# EasyEDA Pro project schematic and PCB.eprj

# Schematic Schematic1
Board Name: Board1; Create Date: 2025-03-21; Page Name: P1; Project Name: New Project_2025-03-21_12-21-42; Schematic Name: Schematic1; Update Date: 2025-03-21; Company: 嘉立创EDA; Page Size: A4; Version: V1.0
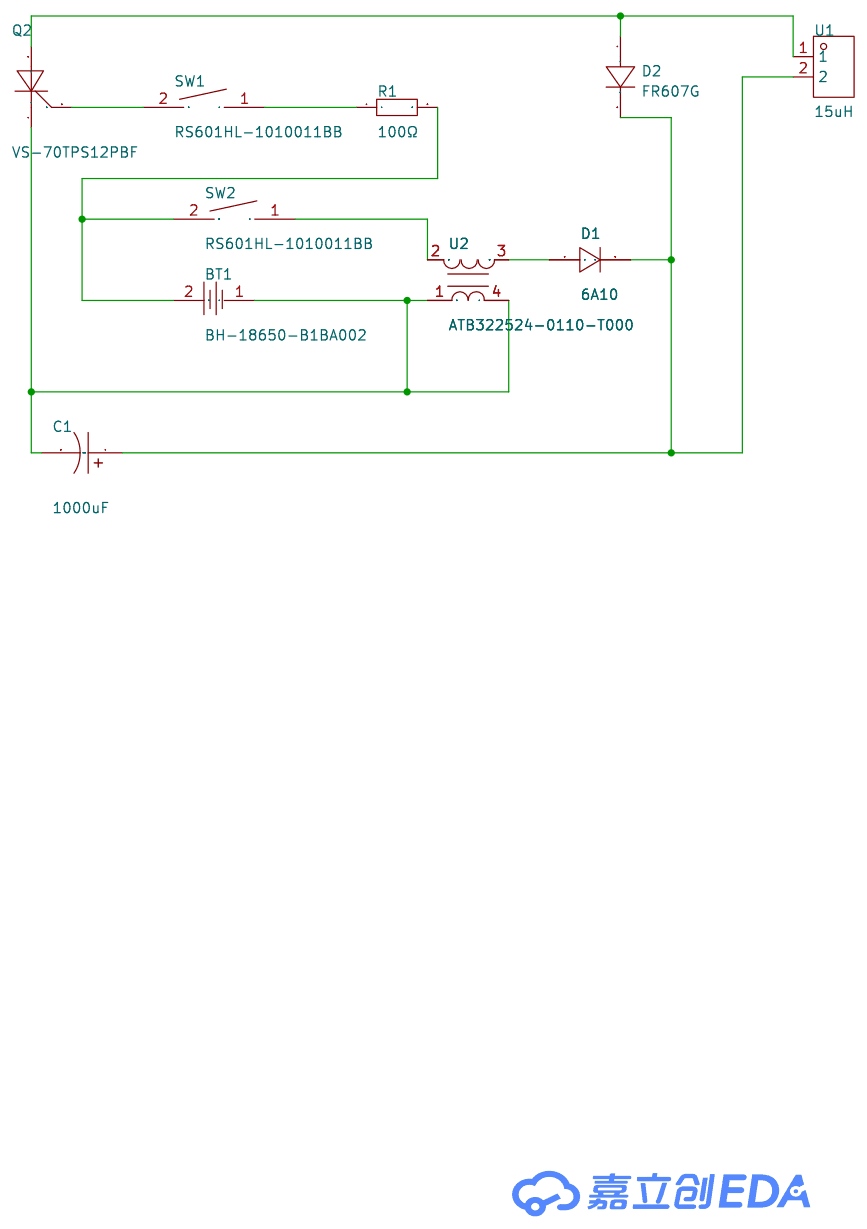
[diagram p0: schematic sheet]

## Parts
BT1  BH-18650-B1BA002  [BATTERY-SMD_18650-1S-L77.1-W20.7-1]
C1  1000uF  [CAP-TH_BD30.0-P10.00-D2.3-FD-1]
D1  6A10  [R-6_BD9.0-L9.0-W9.0-P15.00-D1.7-FD]
D2  FR607G  [DIO-TH_BD8.9-L8.9-P12.85-D1.3-FD]
Q2  VS-70TPS12PBF  [TO-247-3_L15.9-W5.1-P5.44-L]
R1  100Ω  [RES-TH_BD5.0-L15.5-P19.50-D0.70]
SW1  RS601HL-1010011BB  [SW-TH_RS601HL-1010011BB]
SW2  RS601HL-1010011BB  [SW-TH_RS601HL-1010011BB]
U1  15uH  [CND-TEK-SMD_YX-A11-R501053-G0807]
U2  ATB322524-0110-T000  [XFMR-SMD_ATB322515-0110-T000]

## Library data of the parts
BT1 = BH-18650-B1BA002: LCSC Part Name: 电池盒 适用电池:18650; Supplier Part: C2988620; Manufacturer: MYOUNG(美阳); Supplier Footprint: SMD; JLCPCB Part Class: Extended Part; Datasheet: https://atta.szlcsc.com/upload/public/pdf/source/20220402/870DB99AB50CA0DF8D51CF7C86A51FAB.pdf; Supplier: LCSC; Connector Type: 电池盒; Battery Type: 18650
C1 = EKHE451VSN102MR60Z: LCSC Part Name: 1000uF ±20% 450V; Supplier Part: C5142265; Manufacturer: NCC(日本贵弥功); Supplier Footprint: 插件,D30xL60mm; JLCPCB Part Class: Extended Part; Supplier: LCSC; Tolerance: ±20%; Rated Voltage: 450V; φD: 30mm; L: 60mm; Operating Temperature: -25℃~+105℃
D1 = 6A10_C2461: Supplier Part: C2461; Manufacturer: MDD(辰达半导体); Supplier Footprint: R-6; JLCPCB Part Class: Extended Part; Datasheet: https://atta.szlcsc.com/upload/public/pdf/source/20240809/06A0A2C508F91ACDB247A28AEBF87D37.pdf; Supplier: LCSC; Voltage - Forward(Vf@If): 1V@6A; Voltage - DC Reverse(Vr): 1kV; Current - Rectified: 6A; Reverse Leakage Current (Ir): 10uA@1kV
D2 = FR607G: Supplier Part: C961805; Manufacturer: YANGJIE(扬杰); Supplier Footprint: R-6; JLCPCB Part Class: Extended Part; Datasheet: https://atta.szlcsc.com/upload/public/pdf/source/20201127/C961804_3372E6F77B30107D789073F381F4B319.pdf; Supplier: LCSC; Diode Configuration: 独立式; Voltage - Forward(Vf@If): 1.3V@6A; Voltage - DC Reverse(Vr): 1kV; Current - Rectified: 6A; Reverse Leakage Current (Ir): 2.5uA@1kV; Operating Temperature: -55℃~+150℃@(Tj)
Q2 = VS-70TPS12PBF: Supplier Part: C335786; Manufacturer: VISHAY(威世); Supplier Footprint: TO-247-3; JLCPCB Part Class: Extended Part; Datasheet: https://atta.szlcsc.com/upload/public/pdf/source/20181127/C335786_D8343C7FDE24B71D681DA03209FAC9C4.pdf; Supplier: LCSC
R1 = MFR02SF1000A10: LCSC Part Name: 100Ω ±1% 2W 金属膜电阻 小体积,铜脚，圆柱状直插; Supplier Part: C58717; Manufacturer: UNI-ROYAL(厚声); Supplier Footprint: 插件,D4xL11.5mm; JLCPCB Part Class: Extended Part; Datasheet: https://atta.szlcsc.com/upload/public/pdf/source/20191012/C436293_8820AA14BC71FA35E551C06C441482A0.pdf; Supplier: LCSC; Type: 金属膜电阻; Tolerance: ±1%; Voltage-Supply(Max): 500V; Power(Watts): 2W; Temperature Coefficient: ±50ppm/℃
SW1 SW2 = RS601HL-1010011BB: Supplier Part: C2885782; Manufacturer: HCTL(华灿天禄); Supplier Footprint: 插件; JLCPCB Part Class: Extended Part; Datasheet: https://atta.szlcsc.com/upload/public/pdf/source/20210820/B1970E40D09304D7FA648AE2099FB3E8.pdf; Supplier: LCSC; Switch Length: 15mm; Switch Width: 10.5mm; Switch Height: 11.7mm; Actuator Type: 凹面弯曲; With Lamp: 无; Pin Style: 焊片; Actuator Color: 黑色; Contact Current: 3A; Voltage Rating (AC): 250V; Circuit: 单刀单掷; Mechanical Life: 1万次; Operating Temperature: -25℃~+85℃; Actuator Identifier: - O
U1 = YX-A11-R500800-R0890: Supplier Part: C3003210; Manufacturer: CND-tek(磁联达); JLCPCB Part Class: Extended Part; Datasheet: https://atta.szlcsc.com/upload/public/pdf/source/20220506/4D0CC8BB7166D52E801353293D8C1412.pdf; Supplier: LCSC; Function: 发射器; Tolerance: ±10%; Number of Coils: 单线圈,单层; Operating Temperature: -40℃~+85℃
U2 = ATB322524-0110-T000: LCSC Part Name: 升压变压器; Supplier Part: C249001; Manufacturer: TDK; Supplier Footprint: SMD; JLCPCB Part Class: Extended Part; Datasheet: https://atta.szlcsc.com/upload/public/pdf/source/20180719/C249001_45035A300399F2A41F111958812A8988.pdf; Supplier: LCSC

## Nets
$1N757: D2.1 Q2.2(A) U1.1
$1N764: C1.1 D1.2(K) D2.2 U1.2
$1N791: BT1.1 C1.2 Q2.1(K) U2.1 U2.4
$1N998: Q2.3(G) SW1.2
$1N1002: R1.1 SW1.1
$1N1009: BT1.2 R1.2 SW2.2
$1N1038: SW2.1 U2.2
$1N1136: D1.1(A) U2.3

# Board PCB1
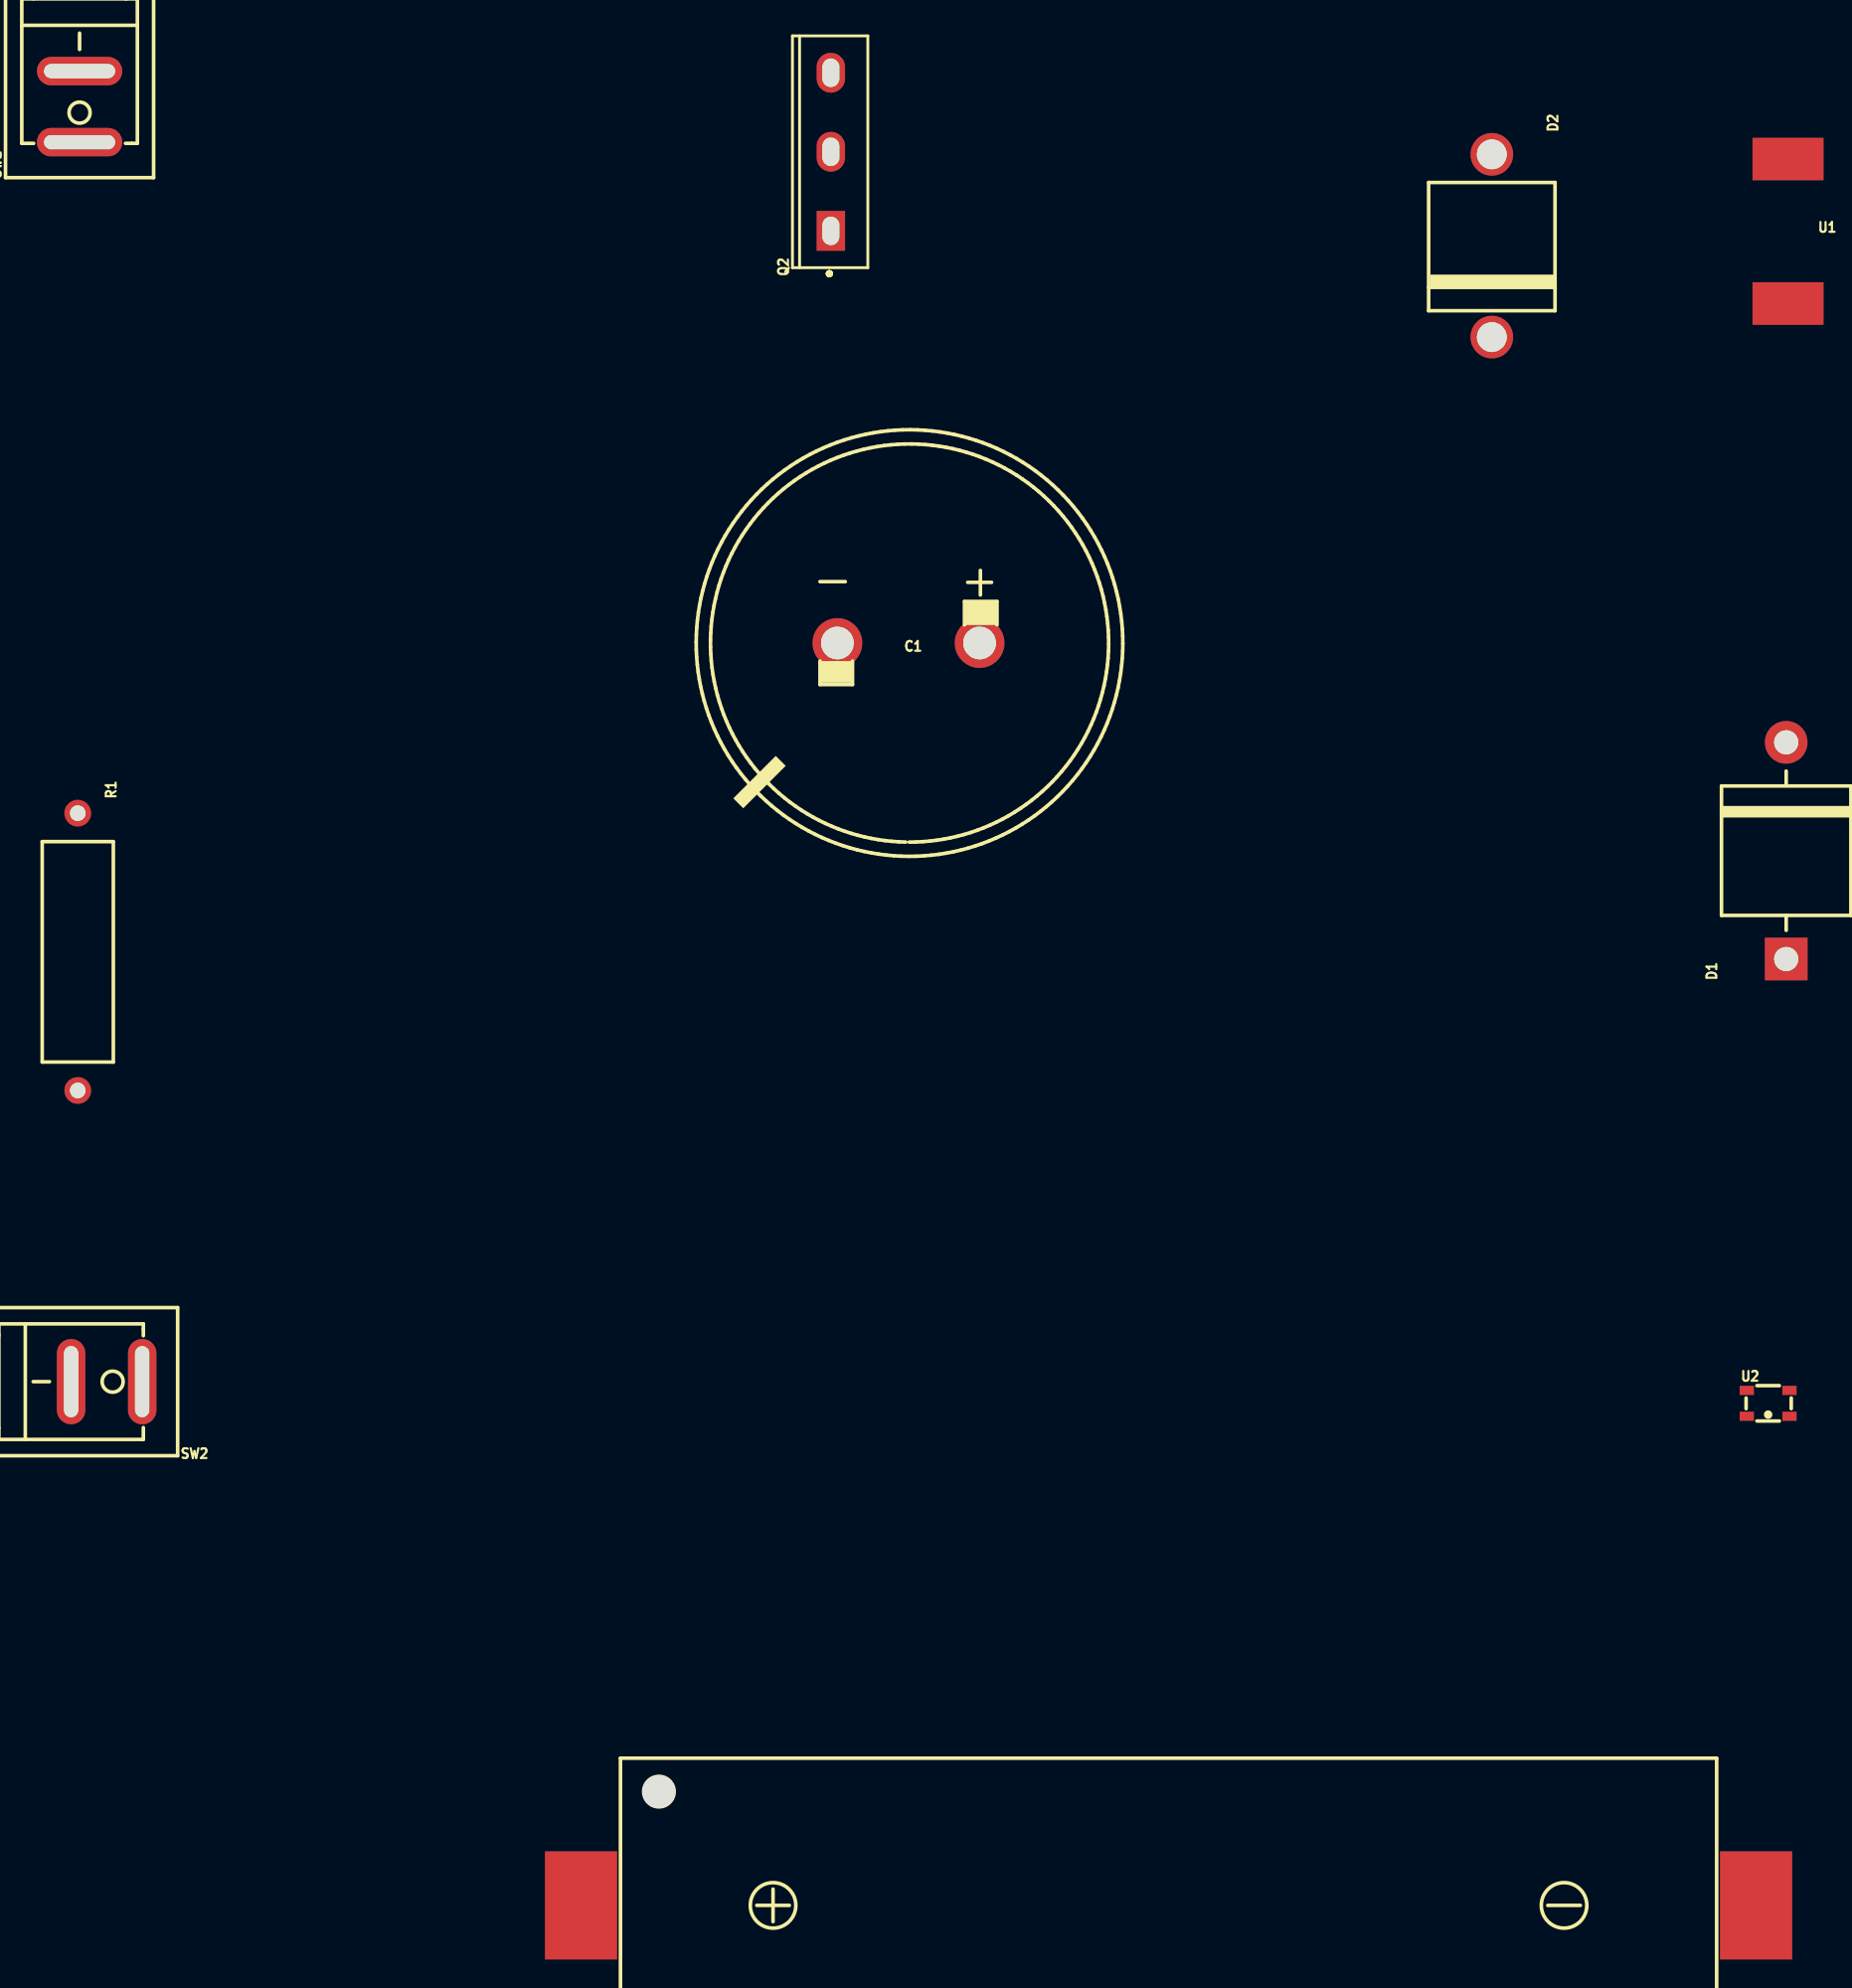
[diagram p1: board, top side]
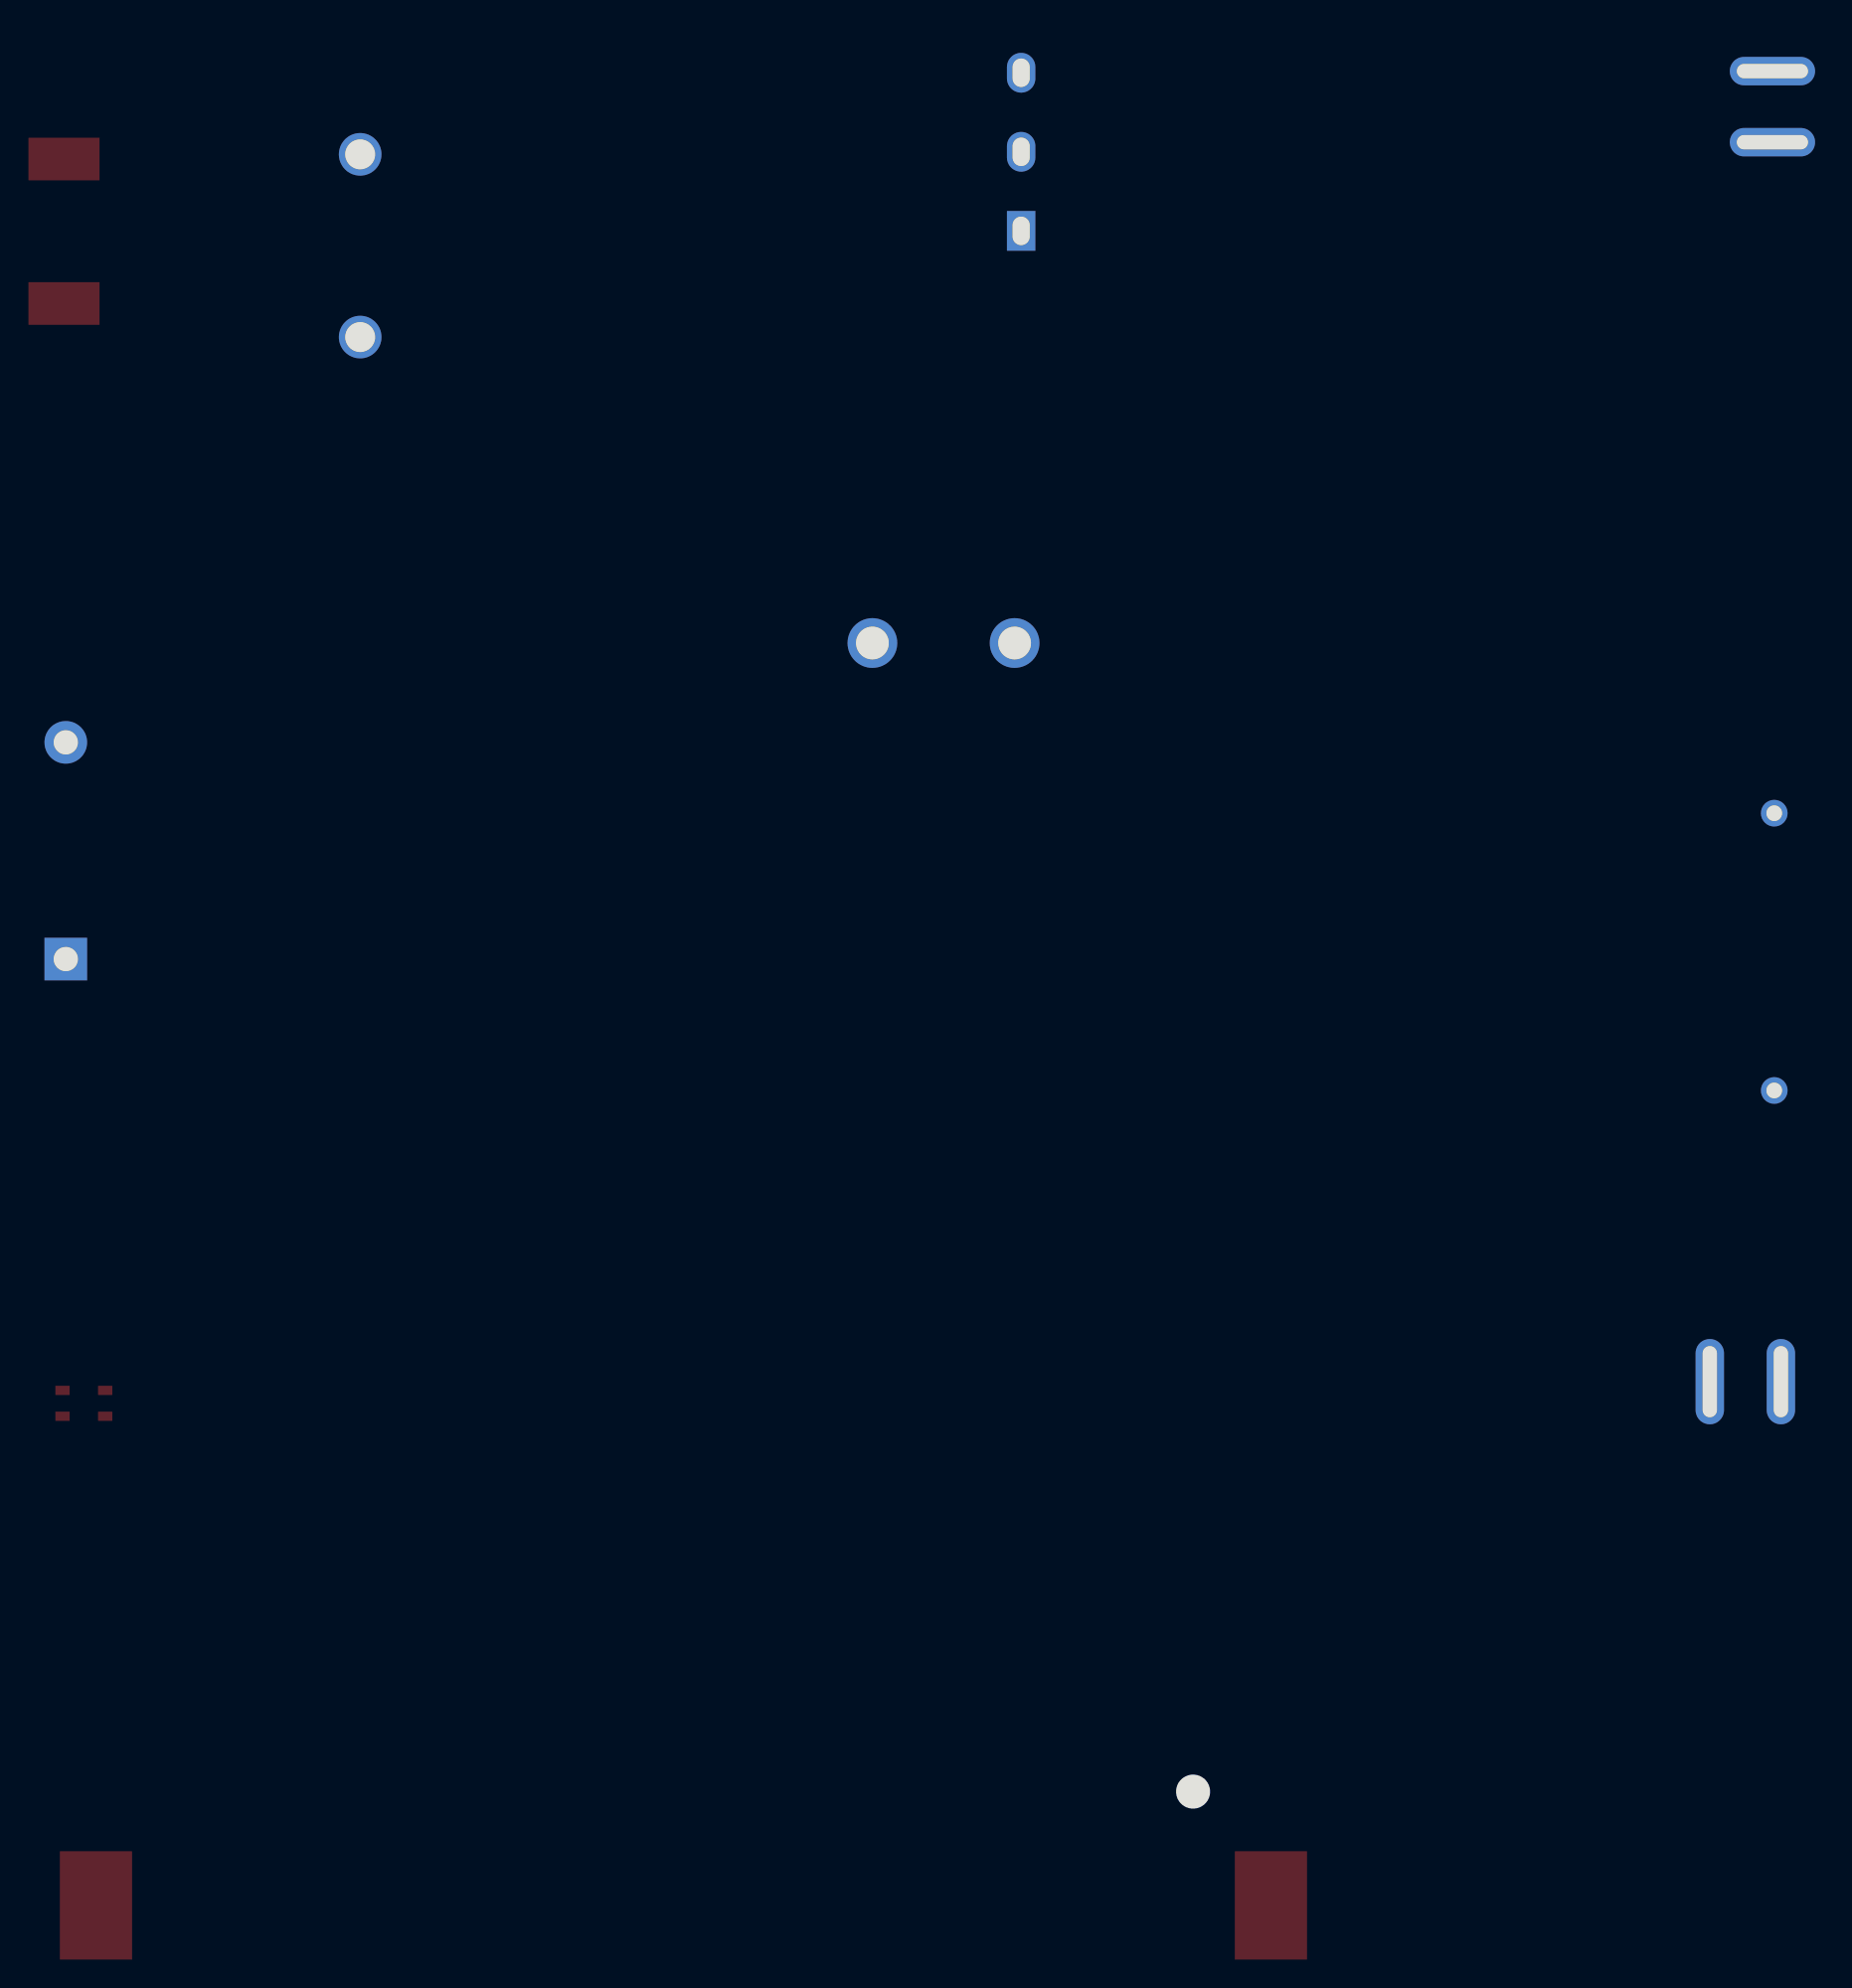
[diagram p2: board, bottom side, seen from below]

Outline 2.39 x 2.39 mm; copper layers: Top Layer, Bottom Layer. Coordinates in mm from the lower left corner of the outline.
Stack: Top Layer 0.035mm / Dielectric1 1.51mm FR4 er 4.5 / Bottom Layer 0.035mm

## Design rules (mm)
template: JLCPCB Capability(Two Layers Board)
spacing copperThickness1oz (default): track to track 0.102, other pairs 0.152 to 0.3
spacing copperThickness2oz: track to track 0.203, other pairs 0.152 to 0.3
track width copperThickness1oz (default): min 0.127, default 0.254, max 2.54
track width copperThickness2oz: min 0.203, default 0.254, max 2.54
differential pair differentialPair (default): width min 0.127, default 0.254, max 2.54; gap min 0.152, default 0.152
via viaSize (default): diameter min 0.5, default 0.61, max 10; hole min 0.3, default 0.305, max 6.3

## Placement (name value [footprint] x y rotation side)
BT1  BH-18650-B1BA002  [BATTERY-SMD_18650-1S-L77.1-W20.7-1]  37.04 -6.8 90 top
C1  1000uF  [CAP-TH_BD30.0-P10.00-D2.3-FD-1]  18.75 81.97 180 top
D1  6A10  [R-6_BD9.0-L9.0-W9.0-P15.00-D1.7-FD]  80.47 67.36 90 top
D2  FR607G  [DIO-TH_BD8.9-L8.9-P12.85-D1.3-FD]  59.77 109.91 270 top
Q2  VS-70TPS12PBF  [TO-247-3_L15.9-W5.1-P5.44-L]  13.29 116.51 90 top
R1  100Ω  [RES-TH_BD5.0-L15.5-P19.50-D0.70]  -39.67 60.25 270 top
SW1  RS601HL-1010011BB  [SW-TH_RS601HL-1010011BB]  -39.54 119.69 90 top
SW2  RS601HL-1010011BB  [SW-TH_RS601HL-1010011BB]  -37.64 30.03 180 top
U1  15uH  [CND-TEK-SMD_YX-A11-R501053-G0807]  80.6 110.93 270 top
U2  ATB322524-0110-T000  [XFMR-SMD_ATB322515-0110-T000]  79.2 28.5 0 top

## Footprints (pads in the part's own frame, mm; a bottom-side part is the same pattern mirrored in y, then rotated)
BATTERY-SMD_18650-1S-L77.1-W20.7-1
  rect 7.62x5.08 smd: 1(0,-41.313) 2(0,41.313)
CAP-TH_BD30.0-P10.00-D2.3-FD-1
  round 3.5 hole 2.3: 1(-5,0) 2(5,0)
CND-TEK-SMD_YX-A11-R501053-G0807
  rect 3x5 smd: 1(-5.08,0) 2(5.08,0)
DIO-TH_BD8.9-L8.9-P12.85-D1.3-FD
  round 3 hole 2.1: 1(-6.425,0) 2(6.425,0)
R-6_BD9.0-L9.0-W9.0-P15.00-D1.7-FD
  rect 3x3 hole 1.7: 1(-7.62,0)
  round 3 hole 1.7: 2(7.62,0)
RES-TH_BD5.0-L15.5-P19.50-D0.70
  round 1.879 hole 1.1: 1(-9.75,0) 2(9.75,0)
SW-TH_RS601HL-1010011BB
  oval 2x6 hole 1x5: 1(-2.5,0) 2(2.5,0)
TO-247-3_L15.9-W5.1-P5.44-L
  rect 2.8x2 hole 2x1.2: 1(-5.56,0)
  oval 2.8x2 hole 2x1.2: 2(0,0) 3(5.56,0)
XFMR-SMD_ATB322515-0110-T000
  rect 1x0.65 smd: 1(-1.5,-0.91) 2(-1.5,0.91) 3(1.5,0.91) 4(1.5,-0.91)

## Nets
As in the schematic.
